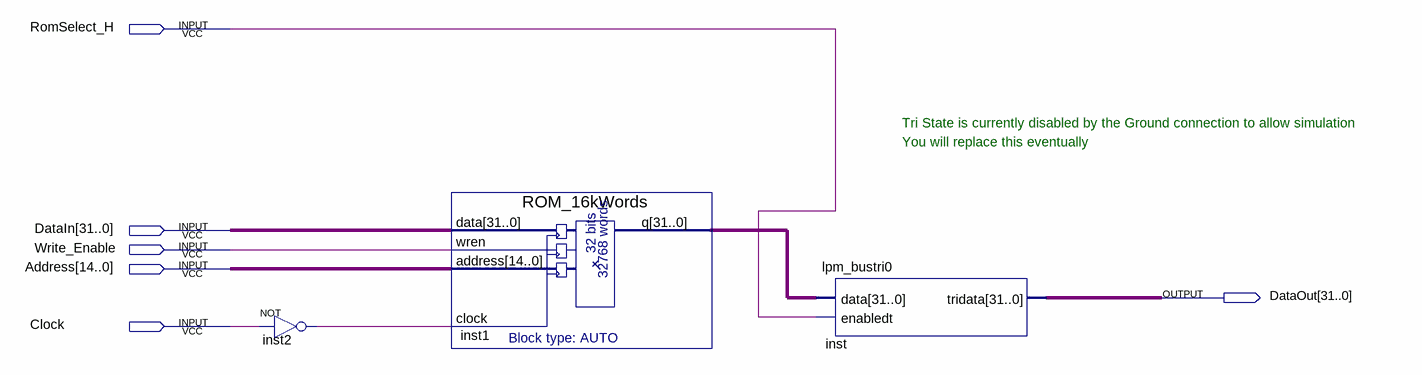
[diagram p0: schematic sheet]
// Quartus schematic OnChipROM16KWords.bdf as structural Verilog: 3 symbols, 6 pins
module OnChipROM16KWords (
  input  RomSelect_H,
  input  [31:0] DataIn,
  input  Write_Enable,
  input  [14:0] Address,
  input  Clock,
  output [31:0] DataOut
);

  wire inst2_out;
  wire [31:0] inst1_q;

  not inst2 (inst2_out, Clock);
  ROM_16kWords inst1 (.data(DataIn), .wren(Write_Enable), .address(Address), .clock(inst2_out), .q(inst1_q));
  lpm_bustri0 inst (.data(inst1_q), .enabledt(RomSelect_H), .tridata(DataOut));

  // Notes on the sheet:
  //   Tri State is currently disabled by the Ground connection to allow simulation
  //   You will replace this eventually
endmodule
